# EAGLE schematic untitled (EAGLE 9.6.2)
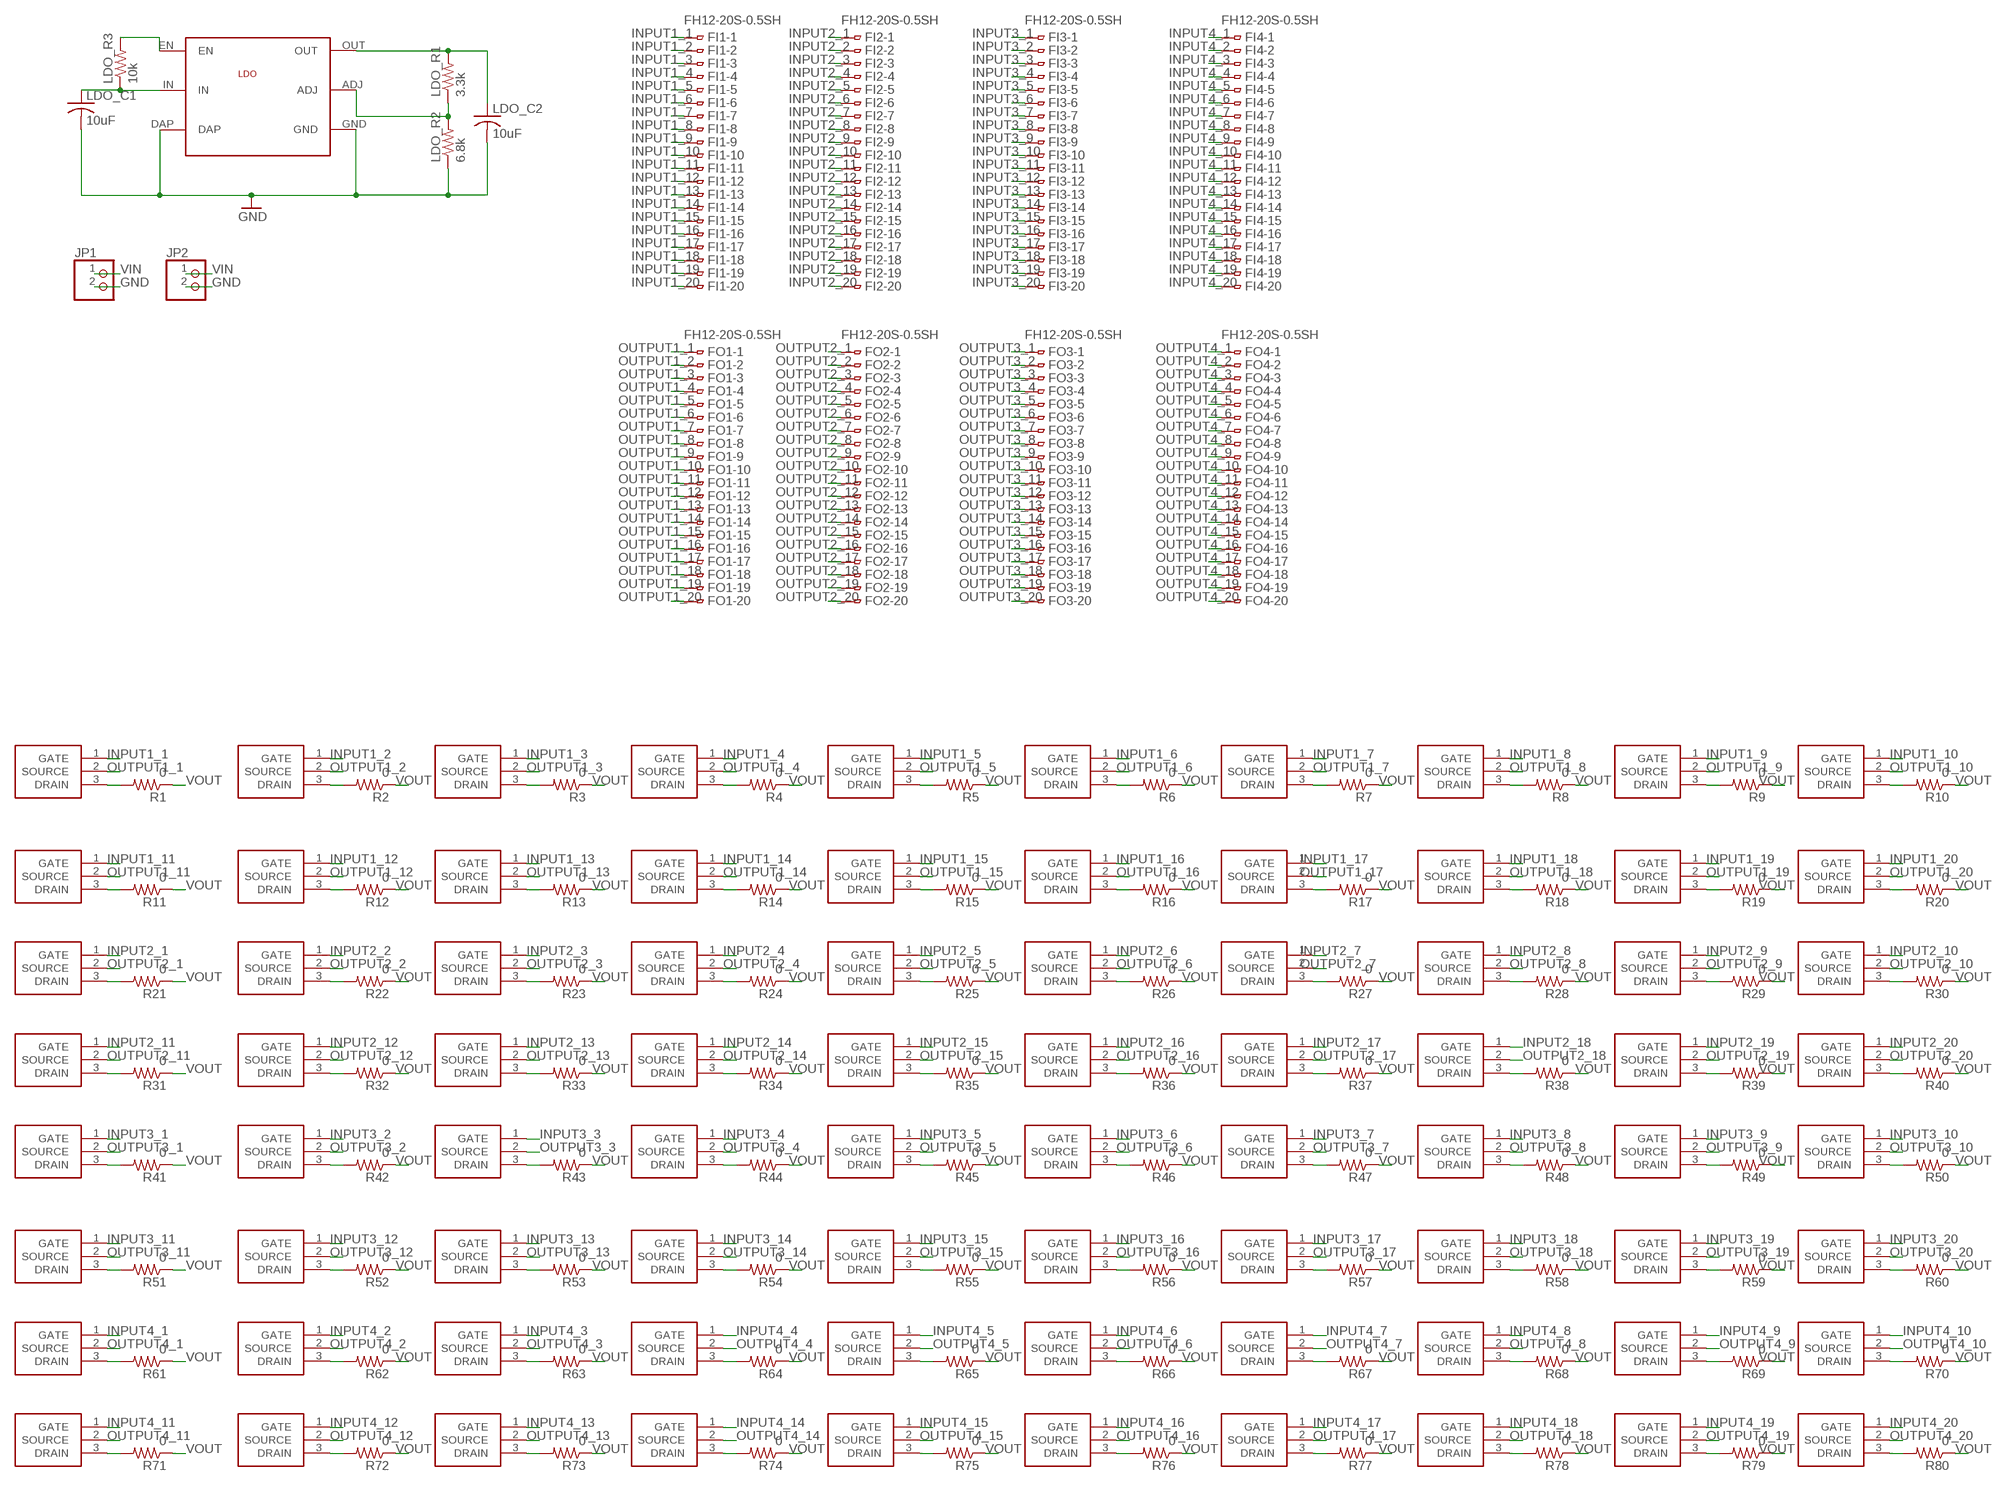
[diagram p0: schematic, sheet 1]

## Parts
FI1  FH12-20S-0.5SH  [FH12-20S-0.5SH]
FI2  FH12-20S-0.5SH  [FH12-20S-0.5SH]
FI3  FH12-20S-0.5SH  [FH12-20S-0.5SH]
FI4  FH12-20S-0.5SH  [FH12-20S-0.5SH]
FO1  FH12-20S-0.5SH  [FH12-20S-0.5SH]
FO2  FH12-20S-0.5SH  [FH12-20S-0.5SH]
FO3  FH12-20S-0.5SH  [FH12-20S-0.5SH]
FO4  FH12-20S-0.5SH  [FH12-20S-0.5SH]
JP1  PINHD-1X2  [1X02]
JP2  PINHD-1X2  [1X02]
LDO  LP38501TS_ADJ  [LP38501TS_ADJ]
LDO_C1  10uF  C-USC0805  [C0805]
LDO_C2  10uF  C-USC0805  [C0805]
LDO_R1  3.3k  R-US_R0805  [R0805]
LDO_R2  6.8k  R-US_R0805  [R0805]
LDO_R3  10k  R-US_R0805  [R0805]
MOS1  NX6008NBKNX6008NBK  [SOT95P240X110-3N]
MOS2  NX6008NBKNX6008NBK  [SOT95P240X110-3N]
MOS3  NX6008NBKNX6008NBK  [SOT95P240X110-3N]
MOS4  NX6008NBKNX6008NBK  [SOT95P240X110-3N]
MOS5  NX6008NBKNX6008NBK  [SOT95P240X110-3N]
MOS6  NX6008NBKNX6008NBK  [SOT95P240X110-3N]
MOS7  NX6008NBKNX6008NBK  [SOT95P240X110-3N]
MOS8  NX6008NBKNX6008NBK  [SOT95P240X110-3N]
MOS9  NX6008NBKNX6008NBK  [SOT95P240X110-3N]
MOS10  NX6008NBKNX6008NBK  [SOT95P240X110-3N]
MOS11  NX6008NBKNX6008NBK  [SOT95P240X110-3N]
MOS12  NX6008NBKNX6008NBK  [SOT95P240X110-3N]
MOS13  NX6008NBKNX6008NBK  [SOT95P240X110-3N]
MOS14  NX6008NBKNX6008NBK  [SOT95P240X110-3N]
MOS15  NX6008NBKNX6008NBK  [SOT95P240X110-3N]
MOS16  NX6008NBKNX6008NBK  [SOT95P240X110-3N]
MOS17  NX6008NBKNX6008NBK  [SOT95P240X110-3N]
MOS18  NX6008NBKNX6008NBK  [SOT95P240X110-3N]
MOS19  NX6008NBKNX6008NBK  [SOT95P240X110-3N]
MOS20  NX6008NBKNX6008NBK  [SOT95P240X110-3N]
MOS21  NX6008NBKNX6008NBK  [SOT95P240X110-3N]
MOS22  NX6008NBKNX6008NBK  [SOT95P240X110-3N]
MOS23  NX6008NBKNX6008NBK  [SOT95P240X110-3N]
MOS24  NX6008NBKNX6008NBK  [SOT95P240X110-3N]
MOS25  NX6008NBKNX6008NBK  [SOT95P240X110-3N]
MOS26  NX6008NBKNX6008NBK  [SOT95P240X110-3N]
MOS27  NX6008NBKNX6008NBK  [SOT95P240X110-3N]
MOS28  NX6008NBKNX6008NBK  [SOT95P240X110-3N]
MOS29  NX6008NBKNX6008NBK  [SOT95P240X110-3N]
MOS30  NX6008NBKNX6008NBK  [SOT95P240X110-3N]
MOS31  NX6008NBKNX6008NBK  [SOT95P240X110-3N]
MOS32  NX6008NBKNX6008NBK  [SOT95P240X110-3N]
MOS33  NX6008NBKNX6008NBK  [SOT95P240X110-3N]
MOS34  NX6008NBKNX6008NBK  [SOT95P240X110-3N]
MOS35  NX6008NBKNX6008NBK  [SOT95P240X110-3N]
MOS36  NX6008NBKNX6008NBK  [SOT95P240X110-3N]
MOS37  NX6008NBKNX6008NBK  [SOT95P240X110-3N]
MOS38  NX6008NBKNX6008NBK  [SOT95P240X110-3N]
MOS39  NX6008NBKNX6008NBK  [SOT95P240X110-3N]
MOS40  NX6008NBKNX6008NBK  [SOT95P240X110-3N]
MOS41  NX6008NBKNX6008NBK  [SOT95P240X110-3N]
MOS42  NX6008NBKNX6008NBK  [SOT95P240X110-3N]
MOS43  NX6008NBKNX6008NBK  [SOT95P240X110-3N]
MOS44  NX6008NBKNX6008NBK  [SOT95P240X110-3N]
MOS45  NX6008NBKNX6008NBK  [SOT95P240X110-3N]
MOS46  NX6008NBKNX6008NBK  [SOT95P240X110-3N]
MOS47  NX6008NBKNX6008NBK  [SOT95P240X110-3N]
MOS48  NX6008NBKNX6008NBK  [SOT95P240X110-3N]
MOS49  NX6008NBKNX6008NBK  [SOT95P240X110-3N]
MOS50  NX6008NBKNX6008NBK  [SOT95P240X110-3N]
MOS51  NX6008NBKNX6008NBK  [SOT95P240X110-3N]
MOS52  NX6008NBKNX6008NBK  [SOT95P240X110-3N]
MOS53  NX6008NBKNX6008NBK  [SOT95P240X110-3N]
MOS54  NX6008NBKNX6008NBK  [SOT95P240X110-3N]
MOS55  NX6008NBKNX6008NBK  [SOT95P240X110-3N]
MOS56  NX6008NBKNX6008NBK  [SOT95P240X110-3N]
MOS57  NX6008NBKNX6008NBK  [SOT95P240X110-3N]
MOS58  NX6008NBKNX6008NBK  [SOT95P240X110-3N]
MOS59  NX6008NBKNX6008NBK  [SOT95P240X110-3N]
MOS60  NX6008NBKNX6008NBK  [SOT95P240X110-3N]
MOS61  NX6008NBKNX6008NBK  [SOT95P240X110-3N]
MOS62  NX6008NBKNX6008NBK  [SOT95P240X110-3N]
MOS63  NX6008NBKNX6008NBK  [SOT95P240X110-3N]
MOS64  NX6008NBKNX6008NBK  [SOT95P240X110-3N]
MOS65  NX6008NBKNX6008NBK  [SOT95P240X110-3N]
MOS66  NX6008NBKNX6008NBK  [SOT95P240X110-3N]
MOS67  NX6008NBKNX6008NBK  [SOT95P240X110-3N]
MOS68  NX6008NBKNX6008NBK  [SOT95P240X110-3N]
MOS69  NX6008NBKNX6008NBK  [SOT95P240X110-3N]
MOS70  NX6008NBKNX6008NBK  [SOT95P240X110-3N]
MOS71  NX6008NBKNX6008NBK  [SOT95P240X110-3N]
MOS72  NX6008NBKNX6008NBK  [SOT95P240X110-3N]
MOS73  NX6008NBKNX6008NBK  [SOT95P240X110-3N]
MOS74  NX6008NBKNX6008NBK  [SOT95P240X110-3N]
MOS75  NX6008NBKNX6008NBK  [SOT95P240X110-3N]
MOS76  NX6008NBKNX6008NBK  [SOT95P240X110-3N]
MOS77  NX6008NBKNX6008NBK  [SOT95P240X110-3N]
MOS78  NX6008NBKNX6008NBK  [SOT95P240X110-3N]
MOS79  NX6008NBKNX6008NBK  [SOT95P240X110-3N]
MOS80  NX6008NBKNX6008NBK  [SOT95P240X110-3N]
R1  0  R-US_R0805  [R0805]
R2  0  R-US_R0805  [R0805]
R3  0  R-US_R0805  [R0805]
R4  0  R-US_R0805  [R0805]
R5  0  R-US_R0805  [R0805]
R6  0  R-US_R0805  [R0805]
R7  0  R-US_R0805  [R0805]
R8  0  R-US_R0805  [R0805]
R9  0  R-US_R0805  [R0805]
R10  0  R-US_R0805  [R0805]
R11  0  R-US_R0805  [R0805]
R12  0  R-US_R0805  [R0805]
R13  0  R-US_R0805  [R0805]
R14  0  R-US_R0805  [R0805]
R15  0  R-US_R0805  [R0805]
R16  0  R-US_R0805  [R0805]
R17  0  R-US_R0805  [R0805]
R18  0  R-US_R0805  [R0805]
R19  0  R-US_R0805  [R0805]
R20  0  R-US_R0805  [R0805]
R21  0  R-US_R0805  [R0805]
R22  0  R-US_R0805  [R0805]
R23  0  R-US_R0805  [R0805]
R24  0  R-US_R0805  [R0805]
R25  0  R-US_R0805  [R0805]
R26  0  R-US_R0805  [R0805]
R27  0  R-US_R0805  [R0805]
R28  0  R-US_R0805  [R0805]
R29  0  R-US_R0805  [R0805]
R30  0  R-US_R0805  [R0805]
R31  0  R-US_R0805  [R0805]
R32  0  R-US_R0805  [R0805]
R33  0  R-US_R0805  [R0805]
R34  0  R-US_R0805  [R0805]
R35  0  R-US_R0805  [R0805]
R36  0  R-US_R0805  [R0805]
R37  0  R-US_R0805  [R0805]
R38  0  R-US_R0805  [R0805]
R39  0  R-US_R0805  [R0805]
R40  0  R-US_R0805  [R0805]
R41  0  R-US_R0805  [R0805]
R42  0  R-US_R0805  [R0805]
R43  0  R-US_R0805  [R0805]
R44  0  R-US_R0805  [R0805]
R45  0  R-US_R0805  [R0805]
R46  0  R-US_R0805  [R0805]
R47  0  R-US_R0805  [R0805]
R48  0  R-US_R0805  [R0805]
R49  0  R-US_R0805  [R0805]
R50  0  R-US_R0805  [R0805]
R51  0  R-US_R0805  [R0805]
R52  0  R-US_R0805  [R0805]
R53  0  R-US_R0805  [R0805]
R54  0  R-US_R0805  [R0805]
R55  0  R-US_R0805  [R0805]
R56  0  R-US_R0805  [R0805]
R57  0  R-US_R0805  [R0805]
R58  0  R-US_R0805  [R0805]
R59  0  R-US_R0805  [R0805]
R60  0  R-US_R0805  [R0805]
R61  0  R-US_R0805  [R0805]
R62  0  R-US_R0805  [R0805]
R63  0  R-US_R0805  [R0805]
R64  0  R-US_R0805  [R0805]
R65  0  R-US_R0805  [R0805]
R66  0  R-US_R0805  [R0805]
R67  0  R-US_R0805  [R0805]
R68  0  R-US_R0805  [R0805]
R69  0  R-US_R0805  [R0805]
R70  0  R-US_R0805  [R0805]
R71  0  R-US_R0805  [R0805]
R72  0  R-US_R0805  [R0805]
R73  0  R-US_R0805  [R0805]
R74  0  R-US_R0805  [R0805]
R75  0  R-US_R0805  [R0805]
R76  0  R-US_R0805  [R0805]
R77  0  R-US_R0805  [R0805]
R78  0  R-US_R0805  [R0805]
R79  0  R-US_R0805  [R0805]
R80  0  R-US_R0805  [R0805]

## Nets
GND: JP1.2 JP2.2 LDO.DAP LDO.GND LDO_C1.2 LDO_C2.2 LDO_R2.1
INPUT1_1: FI1.1 MOS1.1(GATE)
INPUT1_2: FI1.2 MOS2.1(GATE)
INPUT1_3: FI1.3 MOS3.1(GATE)
INPUT1_4: FI1.4 MOS4.1(GATE)
INPUT1_5: FI1.5 MOS5.1(GATE)
INPUT1_6: FI1.6 MOS6.1(GATE)
INPUT1_7: FI1.7 MOS7.1(GATE)
INPUT1_8: FI1.8 MOS8.1(GATE)
INPUT1_9: FI1.9 MOS9.1(GATE)
INPUT1_10: FI1.10 MOS10.1(GATE)
INPUT1_11: FI1.11 MOS11.1(GATE)
INPUT1_12: FI1.12 MOS12.1(GATE)
INPUT1_13: FI1.13 MOS13.1(GATE)
INPUT1_14: FI1.14 MOS14.1(GATE)
INPUT1_15: FI1.15 MOS15.1(GATE)
INPUT1_16: FI1.16 MOS16.1(GATE)
INPUT1_17: FI1.17 MOS17.1(GATE)
INPUT1_18: FI1.18 MOS18.1(GATE)
INPUT1_19: FI1.19 MOS19.1(GATE)
INPUT1_20: FI1.20 MOS20.1(GATE)
INPUT2_1: FI2.1 MOS21.1(GATE)
INPUT2_2: FI2.2 MOS22.1(GATE)
INPUT2_3: FI2.3 MOS23.1(GATE)
INPUT2_4: FI2.4 MOS24.1(GATE)
INPUT2_5: FI2.5 MOS25.1(GATE)
INPUT2_6: FI2.6 MOS26.1(GATE)
INPUT2_7: FI2.7 MOS27.1(GATE)
INPUT2_8: FI2.8 MOS28.1(GATE)
INPUT2_9: FI2.9 MOS29.1(GATE)
INPUT2_10: FI2.10 MOS30.1(GATE)
INPUT2_11: FI2.11 MOS31.1(GATE)
INPUT2_12: FI2.12 MOS32.1(GATE)
INPUT2_13: FI2.13 MOS33.1(GATE)
INPUT2_14: FI2.14 MOS34.1(GATE)
INPUT2_15: FI2.15 MOS35.1(GATE)
INPUT2_16: FI2.16 MOS36.1(GATE)
INPUT2_17: FI2.17 MOS37.1(GATE)
INPUT2_18: FI2.18 MOS38.1(GATE)
INPUT2_19: FI2.19 MOS39.1(GATE)
INPUT2_20: FI2.20 MOS40.1(GATE)
INPUT3_1: FI3.1 MOS41.1(GATE)
INPUT3_2: FI3.2 MOS42.1(GATE)
INPUT3_3: FI3.3 MOS43.1(GATE)
INPUT3_4: FI3.4 MOS44.1(GATE)
INPUT3_5: FI3.5 MOS45.1(GATE)
INPUT3_6: FI3.6 MOS46.1(GATE)
INPUT3_7: FI3.7 MOS47.1(GATE)
INPUT3_8: FI3.8 MOS48.1(GATE)
INPUT3_9: FI3.9 MOS49.1(GATE)
INPUT3_10: FI3.10 MOS50.1(GATE)
INPUT3_11: FI3.11 MOS51.1(GATE)
INPUT3_12: FI3.12 MOS52.1(GATE)
INPUT3_13: FI3.13 MOS53.1(GATE)
INPUT3_14: FI3.14 MOS54.1(GATE)
INPUT3_15: FI3.15 MOS55.1(GATE)
INPUT3_16: FI3.16 MOS56.1(GATE)
INPUT3_17: FI3.17 MOS57.1(GATE)
INPUT3_18: FI3.18 MOS58.1(GATE)
INPUT3_19: FI3.19 MOS59.1(GATE)
INPUT3_20: FI3.20 MOS60.1(GATE)
INPUT4_1: FI4.1 MOS61.1(GATE)
INPUT4_2: FI4.2 MOS62.1(GATE)
INPUT4_3: FI4.3 MOS63.1(GATE)
INPUT4_4: FI4.4 MOS64.1(GATE)
INPUT4_5: FI4.5 MOS65.1(GATE)
INPUT4_6: FI4.6 MOS66.1(GATE)
INPUT4_7: FI4.7 MOS67.1(GATE)
INPUT4_8: FI4.8 MOS68.1(GATE)
INPUT4_9: FI4.9 MOS69.1(GATE)
INPUT4_10: FI4.10 MOS70.1(GATE)
INPUT4_11: FI4.11 MOS71.1(GATE)
INPUT4_12: FI4.12 MOS72.1(GATE)
INPUT4_13: FI4.13 MOS73.1(GATE)
INPUT4_14: FI4.14 MOS74.1(GATE)
INPUT4_15: FI4.15 MOS75.1(GATE)
INPUT4_16: FI4.16 MOS76.1(GATE)
INPUT4_17: FI4.17 MOS77.1(GATE)
INPUT4_18: FI4.18 MOS78.1(GATE)
INPUT4_19: FI4.19 MOS79.1(GATE)
INPUT4_20: FI4.20 MOS80.1(GATE)
N$1: LDO.EN LDO_R3.2
N$2: MOS77.3(DRAIN) R77.2
N$4: LDO.ADJ LDO_R1.1 LDO_R2.2
N$5: MOS1.3(DRAIN) R1.2
N$6: MOS2.3(DRAIN) R2.2
N$10: MOS3.3(DRAIN) R3.2
N$14: MOS4.3(DRAIN) R4.2
N$18: MOS5.3(DRAIN) R5.2
N$22: MOS6.3(DRAIN) R6.2
N$26: MOS7.3(DRAIN) R7.2
N$30: MOS8.3(DRAIN) R8.2
N$34: MOS9.3(DRAIN) R9.2
N$38: MOS10.3(DRAIN) R10.2
N$40: MOS11.3(DRAIN) R11.2
N$43: MOS12.3(DRAIN) R12.2
N$47: MOS13.3(DRAIN) R13.2
N$51: MOS14.3(DRAIN) R14.2
N$55: MOS15.3(DRAIN) R15.2
N$59: MOS16.3(DRAIN) R16.2
N$63: MOS17.3(DRAIN) R17.2
N$67: MOS18.3(DRAIN) R18.2
N$71: MOS19.3(DRAIN) R19.2
N$75: MOS20.3(DRAIN) R20.2
N$77: MOS21.3(DRAIN) R21.2
N$80: MOS22.3(DRAIN) R22.2
N$84: MOS23.3(DRAIN) R23.2
N$88: MOS24.3(DRAIN) R24.2
N$92: MOS25.3(DRAIN) R25.2
N$96: MOS26.3(DRAIN) R26.2
N$100: MOS27.3(DRAIN) R27.2
N$104: MOS28.3(DRAIN) R28.2
N$108: MOS29.3(DRAIN) R29.2
N$112: MOS30.3(DRAIN) R30.2
N$114: MOS31.3(DRAIN) R31.2
N$117: MOS32.3(DRAIN) R32.2
N$121: MOS33.3(DRAIN) R33.2
N$125: MOS34.3(DRAIN) R34.2
N$129: MOS35.3(DRAIN) R35.2
N$133: MOS36.3(DRAIN) R36.2
N$137: MOS37.3(DRAIN) R37.2
N$141: MOS38.3(DRAIN) R38.2
N$145: MOS39.3(DRAIN) R39.2
N$149: MOS40.3(DRAIN) R40.2
N$151: MOS41.3(DRAIN) R41.2
N$154: MOS42.3(DRAIN) R42.2
N$158: MOS43.3(DRAIN) R43.2
N$162: MOS44.3(DRAIN) R44.2
N$166: MOS45.3(DRAIN) R45.2
N$170: MOS46.3(DRAIN) R46.2
N$174: MOS47.3(DRAIN) R47.2
N$178: MOS48.3(DRAIN) R48.2
N$182: MOS49.3(DRAIN) R49.2
N$186: MOS50.3(DRAIN) R50.2
N$188: MOS51.3(DRAIN) R51.2
N$191: MOS52.3(DRAIN) R52.2
N$195: MOS53.3(DRAIN) R53.2
N$199: MOS54.3(DRAIN) R54.2
N$203: MOS55.3(DRAIN) R55.2
N$207: MOS56.3(DRAIN) R56.2
N$211: MOS57.3(DRAIN) R57.2
N$215: MOS58.3(DRAIN) R58.2
N$219: MOS59.3(DRAIN) R59.2
N$223: MOS60.3(DRAIN) R60.2
N$225: MOS61.3(DRAIN) R61.2
N$228: MOS62.3(DRAIN) R62.2
N$232: MOS63.3(DRAIN) R63.2
N$236: MOS64.3(DRAIN) R64.2
N$240: MOS65.3(DRAIN) R65.2
N$244: MOS66.3(DRAIN) R66.2
N$248: MOS67.3(DRAIN) R67.2
N$252: MOS68.3(DRAIN) R68.2
N$256: MOS69.3(DRAIN) R69.2
N$260: MOS70.3(DRAIN) R70.2
N$262: MOS71.3(DRAIN) R71.2
N$265: MOS72.3(DRAIN) R72.2
N$269: MOS73.3(DRAIN) R73.2
N$273: MOS74.3(DRAIN) R74.2
N$277: MOS75.3(DRAIN) R75.2
N$281: MOS76.3(DRAIN) R76.2
N$289: MOS78.3(DRAIN) R78.2
N$293: MOS79.3(DRAIN) R79.2
N$297: MOS80.3(DRAIN) R80.2
OUTPUT1_1: FO1.1 MOS1.2(SOURCE)
OUTPUT1_2: FO1.2 MOS2.2(SOURCE)
OUTPUT1_3: FO1.3 MOS3.2(SOURCE)
OUTPUT1_4: FO1.4 MOS4.2(SOURCE)
OUTPUT1_5: FO1.5 MOS5.2(SOURCE)
OUTPUT1_6: FO1.6 MOS6.2(SOURCE)
OUTPUT1_7: FO1.7 MOS7.2(SOURCE)
OUTPUT1_8: FO1.8 MOS8.2(SOURCE)
OUTPUT1_9: FO1.9 MOS9.2(SOURCE)
OUTPUT1_10: FO1.10 MOS10.2(SOURCE)
OUTPUT1_11: FO1.11 MOS11.2(SOURCE)
OUTPUT1_12: FO1.12 MOS12.2(SOURCE)
OUTPUT1_13: FO1.13 MOS13.2(SOURCE)
OUTPUT1_14: FO1.14 MOS14.2(SOURCE)
OUTPUT1_15: FO1.15 MOS15.2(SOURCE)
OUTPUT1_16: FO1.16 MOS16.2(SOURCE)
OUTPUT1_17: FO1.17 MOS17.2(SOURCE)
OUTPUT1_18: FO1.18 MOS18.2(SOURCE)
OUTPUT1_19: FO1.19 MOS19.2(SOURCE)
OUTPUT1_20: FO1.20 MOS20.2(SOURCE)
OUTPUT2_1: FO2.1 MOS21.2(SOURCE)
OUTPUT2_2: FO2.2 MOS22.2(SOURCE)
OUTPUT2_3: FO2.3 MOS23.2(SOURCE)
OUTPUT2_4: FO2.4 MOS24.2(SOURCE)
OUTPUT2_5: FO2.5 MOS25.2(SOURCE)
OUTPUT2_6: FO2.6 MOS26.2(SOURCE)
OUTPUT2_7: FO2.7 MOS27.2(SOURCE)
OUTPUT2_8: FO2.8 MOS28.2(SOURCE)
OUTPUT2_9: FO2.9 MOS29.2(SOURCE)
OUTPUT2_10: FO2.10 MOS30.2(SOURCE)
OUTPUT2_11: FO2.11 MOS31.2(SOURCE)
OUTPUT2_12: FO2.12 MOS32.2(SOURCE)
OUTPUT2_13: FO2.13 MOS33.2(SOURCE)
OUTPUT2_14: FO2.14 MOS34.2(SOURCE)
OUTPUT2_15: FO2.15 MOS35.2(SOURCE)
OUTPUT2_16: FO2.16 MOS36.2(SOURCE)
OUTPUT2_17: FO2.17 MOS37.2(SOURCE)
OUTPUT2_18: FO2.18 MOS38.2(SOURCE)
OUTPUT2_19: FO2.19 MOS39.2(SOURCE)
OUTPUT2_20: FO2.20 MOS40.2(SOURCE)
OUTPUT3_1: FO3.1 MOS41.2(SOURCE)
OUTPUT3_2: FO3.2 MOS42.2(SOURCE)
OUTPUT3_3: FO3.3 MOS43.2(SOURCE)
OUTPUT3_4: FO3.4 MOS44.2(SOURCE)
OUTPUT3_5: FO3.5 MOS45.2(SOURCE)
OUTPUT3_6: FO3.6 MOS46.2(SOURCE)
OUTPUT3_7: FO3.7 MOS47.2(SOURCE)
OUTPUT3_8: FO3.8 MOS48.2(SOURCE)
OUTPUT3_9: FO3.9 MOS49.2(SOURCE)
OUTPUT3_10: FO3.10 MOS50.2(SOURCE)
OUTPUT3_11: FO3.11 MOS51.2(SOURCE)
OUTPUT3_12: FO3.12 MOS52.2(SOURCE)
OUTPUT3_13: FO3.13 MOS53.2(SOURCE)
OUTPUT3_14: FO3.14 MOS54.2(SOURCE)
OUTPUT3_15: FO3.15 MOS55.2(SOURCE)
OUTPUT3_16: FO3.16 MOS56.2(SOURCE)
OUTPUT3_17: FO3.17 MOS57.2(SOURCE)
OUTPUT3_18: FO3.18 MOS58.2(SOURCE)
OUTPUT3_19: FO3.19 MOS59.2(SOURCE)
OUTPUT3_20: FO3.20 MOS60.2(SOURCE)
OUTPUT4_1: FO4.1 MOS61.2(SOURCE)
OUTPUT4_2: FO4.2 MOS62.2(SOURCE)
OUTPUT4_3: FO4.3 MOS63.2(SOURCE)
OUTPUT4_4: FO4.4 MOS64.2(SOURCE)
OUTPUT4_5: FO4.5 MOS65.2(SOURCE)
OUTPUT4_6: FO4.6 MOS66.2(SOURCE)
OUTPUT4_7: FO4.7 MOS67.2(SOURCE)
OUTPUT4_8: FO4.8 MOS68.2(SOURCE)
OUTPUT4_9: FO4.9 MOS69.2(SOURCE)
OUTPUT4_10: FO4.10 MOS70.2(SOURCE)
OUTPUT4_11: FO4.11 MOS71.2(SOURCE)
OUTPUT4_12: FO4.12 MOS72.2(SOURCE)
OUTPUT4_13: FO4.13 MOS73.2(SOURCE)
OUTPUT4_14: FO4.14 MOS74.2(SOURCE)
OUTPUT4_15: FO4.15 MOS75.2(SOURCE)
OUTPUT4_16: FO4.16 MOS76.2(SOURCE)
OUTPUT4_17: FO4.17 MOS77.2(SOURCE)
OUTPUT4_18: FO4.18 MOS78.2(SOURCE)
OUTPUT4_19: FO4.19 MOS79.2(SOURCE)
OUTPUT4_20: FO4.20 MOS80.2(SOURCE)
VIN: JP1.1 JP2.1 LDO.IN LDO_C1.1 LDO_R3.1
VOUT: LDO.OUT LDO_C2.1 LDO_R1.2 R1.1 R2.1 R3.1 R4.1 R5.1 R6.1 R7.1 R8.1 R9.1 R10.1 R11.1 R12.1 R13.1 R14.1 R15.1 R16.1 R17.1 R18.1 R19.1 R20.1 R21.1 R22.1 R23.1 R24.1 R25.1 R26.1 R27.1 R28.1 R29.1 R30.1 R31.1 R32.1 R33.1 R34.1 R35.1 R36.1 R37.1 R38.1 R39.1 R40.1 R41.1 R42.1 R43.1 R44.1 R45.1 R46.1 R47.1 R48.1 R49.1 R50.1 R51.1 R52.1 R53.1 R54.1 R55.1 R56.1 R57.1 R58.1 R59.1 R60.1 R61.1 R62.1 R63.1 R64.1 R65.1 R66.1 R67.1 R68.1 R69.1 R70.1 R71.1 R72.1 R73.1 R74.1 R75.1 R76.1 R77.1 R78.1 R79.1 R80.1

## Library data of the parts
FI1-FI4 FO1-FO4 = con-hirose:FH12-20S-0.5S: 0.5mm Pitch Connectors For FPC/FFC Source: Data sheet <http://www.hirose.co.jp/cataloge_hp/e58605370.pdf>; MPN: FH12-20S-0.5SH(55); OC_FARNELL: 1324549; OC_NEWARK: 34M6166
JP1 JP2 = pinhead:PINHD-1X2: PIN HEADER
LDO = LP38501TS_ADJ_byHsia:LP38501TS_ADJ
LDO_C1 LDO_C2 = rcl:C-US: CAPACITOR, American symbol; SPICEPREFIX: C
LDO_R1-LDO_R3 R1-R80 = rcl:R-US_: RESISTOR, American symbol; SPICEPREFIX: R
MOS1-MOS80 = NX6008NBK_byHsia:NX6008NBK